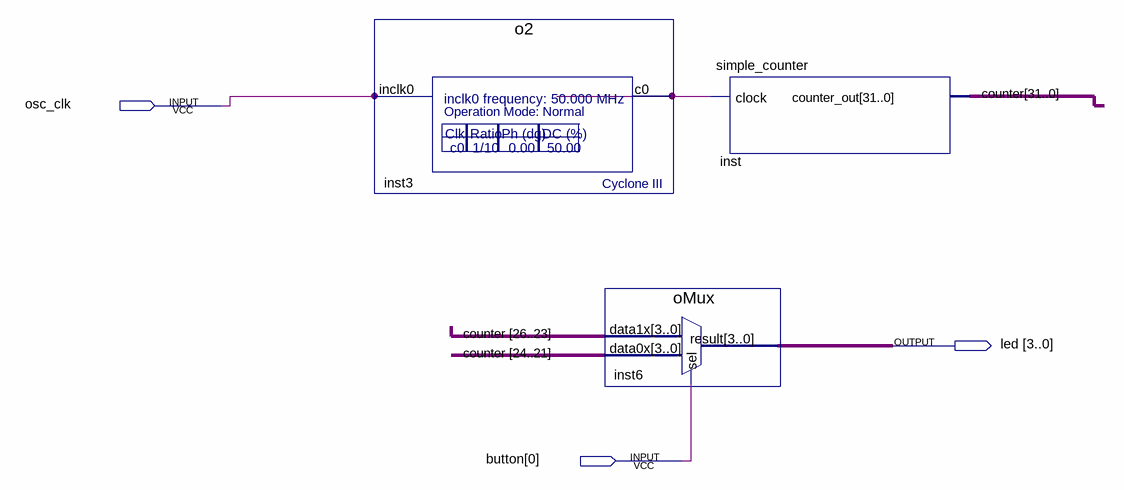
[diagram p0: schematic sheet]
// Quartus schematic testmdo_top.bdf as structural Verilog: 3 symbols, 3 pins
module testmdo_top (
  input  osc_clk,
  input  [0:0] button,
  output [3:0] led
);

  wire inst3_c0;
  wire [31:0] counter;

  o2 inst3 (.inclk0(osc_clk), .c0(inst3_c0));
  oMux inst6 (.data1x(counter[26:23]), .data0x(counter[24:21]), .sel(button[0]), .result(led));
  simple_counter inst (.clock(inst3_c0), .counter_out(counter));
endmodule
